# EAGLE design POVDisplayBase (EAGLE 7.4.0)
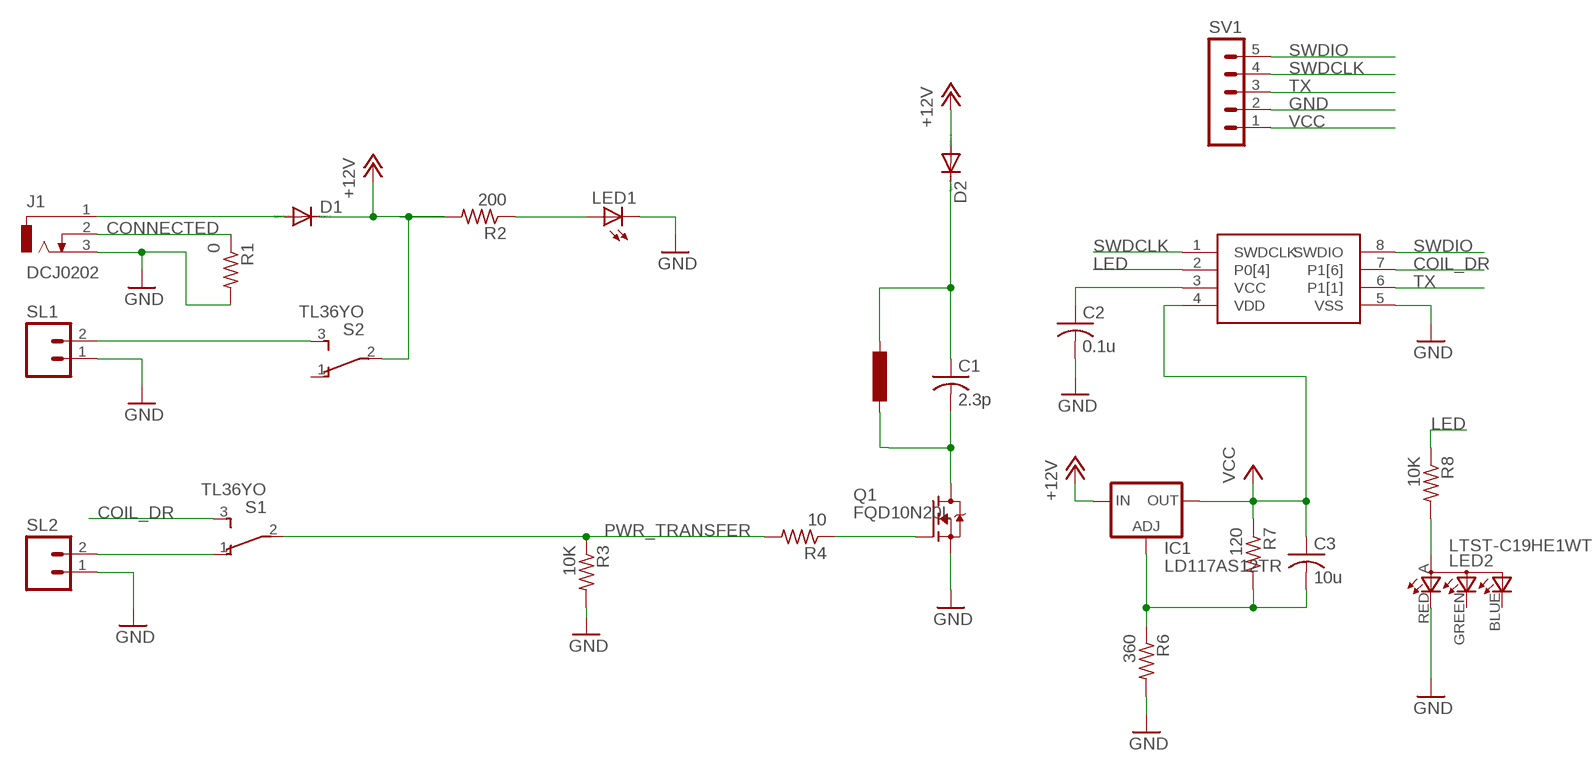
[diagram p0: schematic, sheet 1]
L1 (L): INDUCTANCE: 36.2uH

## Parts
C1  2.3p  C-USC1210  [C1210]
C2  0.1u  C-USC0603  [C0603]
C3  10u  C-USC0603  [C0603]
D1  DIODE-DO-214AC  [DO-214AC]
D2  DIODE-SMC  [SMC]
IC1  LD117AS12TR  [SOT223]
J1  DCJ0202  [DCJ0202]
LED1  LEDCHIPLED_1206  [CHIPLED_1206]
LED2  LTST-C19HE1WT  [LTST-C19HE1WT]
Q1  FQD10N20L  [TO252]
R1  0  R-US_R0603  [R0603]
R2  200  R-US_R0603  [R0603]
R3  10K  R-US_R0603  [R0603]
R4  10  R-US_R0603  [R0603]
R6  360  R-US_R0603  [R0603]
R7  120  R-US_R0603  [R0603]
R8  10K  R-US_R0603  [R0603]
S1  TL36YO  [TL3XYO]
S2  TL36YO  [TL3XYO]
SL1  M02  [02P]
SL2  M02  [02P]
SV1  MA05-1  [MA05-1]
U1  CY8C4013SXI-400  [SOIC08]

## Nets
+12V: D1.C D2.A IC1.3(IN) R2.2 S2.2(P)
COIL_DR: S1.3(S) U1.7(P1[6])
CONNECTED: J1.2 R1.1
GND: C2.2 J1.3 LED1.C LED2.RED(CRED) Q1.2(S) R1.2 R3.2 R6.2 SL1.1 SL2.1 SV1.2 U1.5(VSS)
LED: R8.1 U1.2(P0[4])
N$1: Q1.1(G) R4.1
N$2: LED1.A R2.1
N$3: S2.3(S) SL1.2
N$4: D1.A J1.1
N$5: C3.2 IC1.1(ADJ) R6.1 R7.2
N$6: LED2.A R8.2
N$7: C2.1 U1.3(VCC)
N$13: S1.1(O) SL2.2
NEG_COIL: C1.2 Q1.3(D)
POS_COIL: C1.1 D2.C
PWR_TRANSFER: R3.1 R4.2 S1.2(P)
SWDCLK: SV1.4 U1.1(SWDCLK)
SWDIO: SV1.5 U1.8(SWDIO)
TX: SV1.3 U1.6(P1[1])
VCC: C3.1 IC1.4(OUT) R7.1 SV1.1 U1.4(VDD)
Unconnected: LED2.BLUE(CBLUE) LED2.GREEN(CGREEN) S2.1(O)

## Library data of the parts
C1-C3 = resistor:C-US: CAPACITOR, American symbol
D1 = diode:DIODE-: DIODE; DIGIKEY: 641-1707-1-ND
D2 = diode:DIODE-: DIODE; DIGIKEY: S5KC-FDICT-ND
IC1 = v-reg:LD117A?*: Low drop fixed and adjustable positive voltage regulators 1 A Source: http://www.st.com/stonline/products/literature/ds/7194/ld1117axx.pdf
J1 = con-jack:DCJ0202: DC POWER JACK Source: DCJ0202.pdf; DIGIKEY: CP-002B-ND; MATING_CONN: CP3-1001-ND; OC_FARNELL: unknown; OC_NEWARK: unknown
LED1 = led:LED: LED OSRAM: - CHIPLED LG R971, LG N971, LY N971, LG Q971, LY Q971, LO R971, LY R971 LH N974, LH R974 LS Q976, LO Q976, LY Q976 LO Q996 - Hyper CHIPLED LW Q18S LB Q993, LB Q99A, LB R99A - SideLED LS A670, LO A670, LY A670, LG A670, LP A670 LB A673, LV A673, LT A673, LW A673 LH A674 LY A675 LS A676, LA A676, LO A676, LY A676, LW A676 LS A679, LY A679, LG A679 - Hyper Micro SIDELED® LS Y876, LA Y876, LO Y876, LY Y876 LT Y87S - SmartLED LW L88C, LW L88S LB L89C, LB L89S, LG L890 LS L89K, LO L89K, LY L89K LS L896, LA L896, LO L896, LY L896 - TOPLED LS T670, LO T670, LY T670, LG T670, LP T670 LSG T670, LSP T670, LSY T670, LOP T670, LYG T670 LG T671, LOG T671, LSG T671 LB T673, LV T673, LT T673, LW T673 LH T674 LS T676, LA T676, LO T676, LY T676, LB T676, LH T676, LSB T676, LW T676 LB T67C, LV T67C, LT T67C, LS T67K, LO T67K, LY T67K, LW E67C LS E67B, LA E67B, LO E67B, LY E67B, LB E67C, LV E67C, LT E67C LW T67C LS T679, LY T679, LG T679 LS T770, LO T770, LY T770, LG T770, LP T770 LB T773, LV T773, LT T773, LW T773 LH T774 LS E675, LA E675, LY E675, LS T675 LS T776, LA T776, LO T776, LY T776, LB T776 LHGB T686 LT T68C, LB T68C - Hyper Mini TOPLED® LB M676 - Mini TOPLED Santana® LG M470 LS M47K, LO M47K, LY M47K Source: http://www.osram.convergy.de LUXEON: - LUMILED® LXK2-PW12-R00, LXK2-PW12-S00, LXK2-PW14-U00, LXK2-PW14-V00 LXK2-PM12-R00, LXK2-PM12-S00, LXK2-PM14-U00 LXK2-PE12-Q00, LXK2-PE12-R00, LXK2-PE12-S00, LXK2-PE14-T00, LXK2-PE14-U00 LXK2-PB12-K00, LXK2-PB12-L00, LXK2-PB12-M00, LXK2-PB14-N00, LXK2-PB14-P00, LXK2-PB14-Q00 LXK2-PR12-L00, LXK2-PR12-M00, LXK2-PR14-Q00, LXK2-PR14-R00 LXK2-PD12-Q00, LXK2-PD12-R00, LXK2-PD12-S00 LXK2-PH12-R00, LXK2-PH12-S00 LXK2-PL12-P00, LXK2-PL12-Q00, LXK2-PL12-R00 Source: www.luxeon.com KINGBRIGHT: KA-3528ASYC Source: www.kingbright.com; DIGIKEY: 1080-1346-1-ND
LED2 = NicksParts:LTST-C19HE1WT
Q1 = NicksParts:FQD10N20L; DIGIKEY: FQD10N20LTMCT-ND
R1-R4 R6-R8 = resistor:R-US_: RESISTOR, American symbol; DIGIKEY: P180GCT-ND
S1 S2 = switch:TL36YO: TINY SWITCH ON - ON Source: http://www2.produktinfo.conrad.com/datenblaetter/700000-724999/705152-da-01-de-Subminiaturschalter_TL_36YO.pdf; DIGIKEY: 450-1603-ND
SL1 SL2 = con-amp-quick:M02: AMP QUICK CONNECTOR; OC_FARNELL: unknown; OC_NEWARK: unknown
SV1 = con-lstb:MA05-1: PIN HEADER; OC_FARNELL: unknown; OC_NEWARK: unknown
U1 = NicksParts:CY8C4013SXI-400

## Board
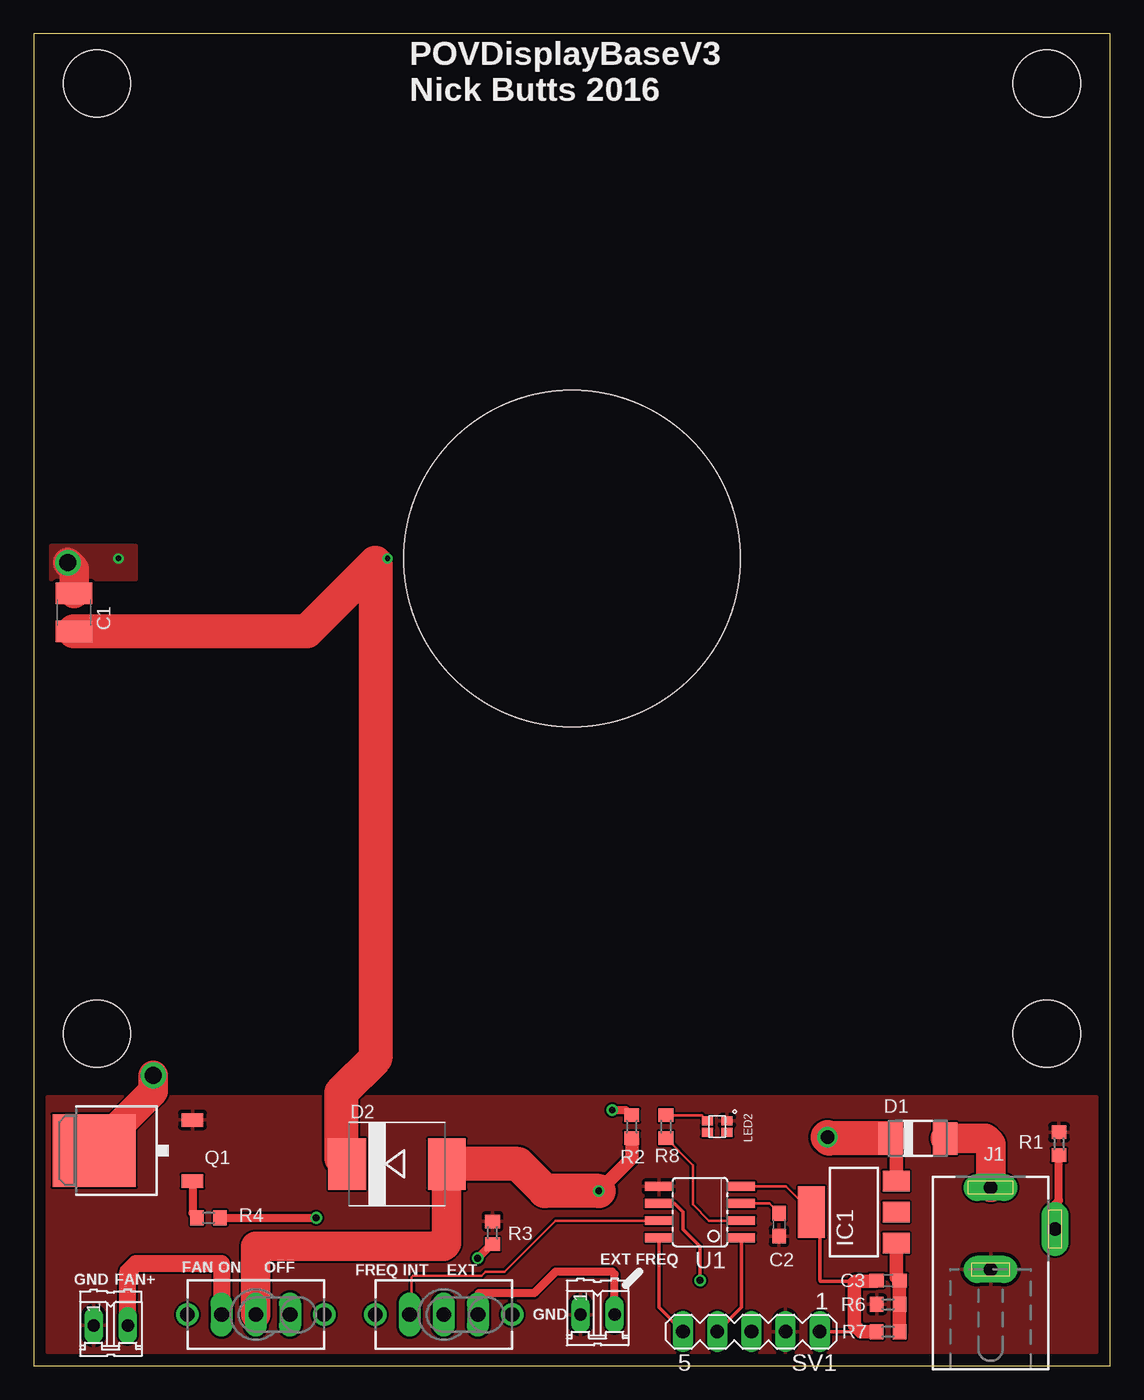
[diagram p1: board, top side]
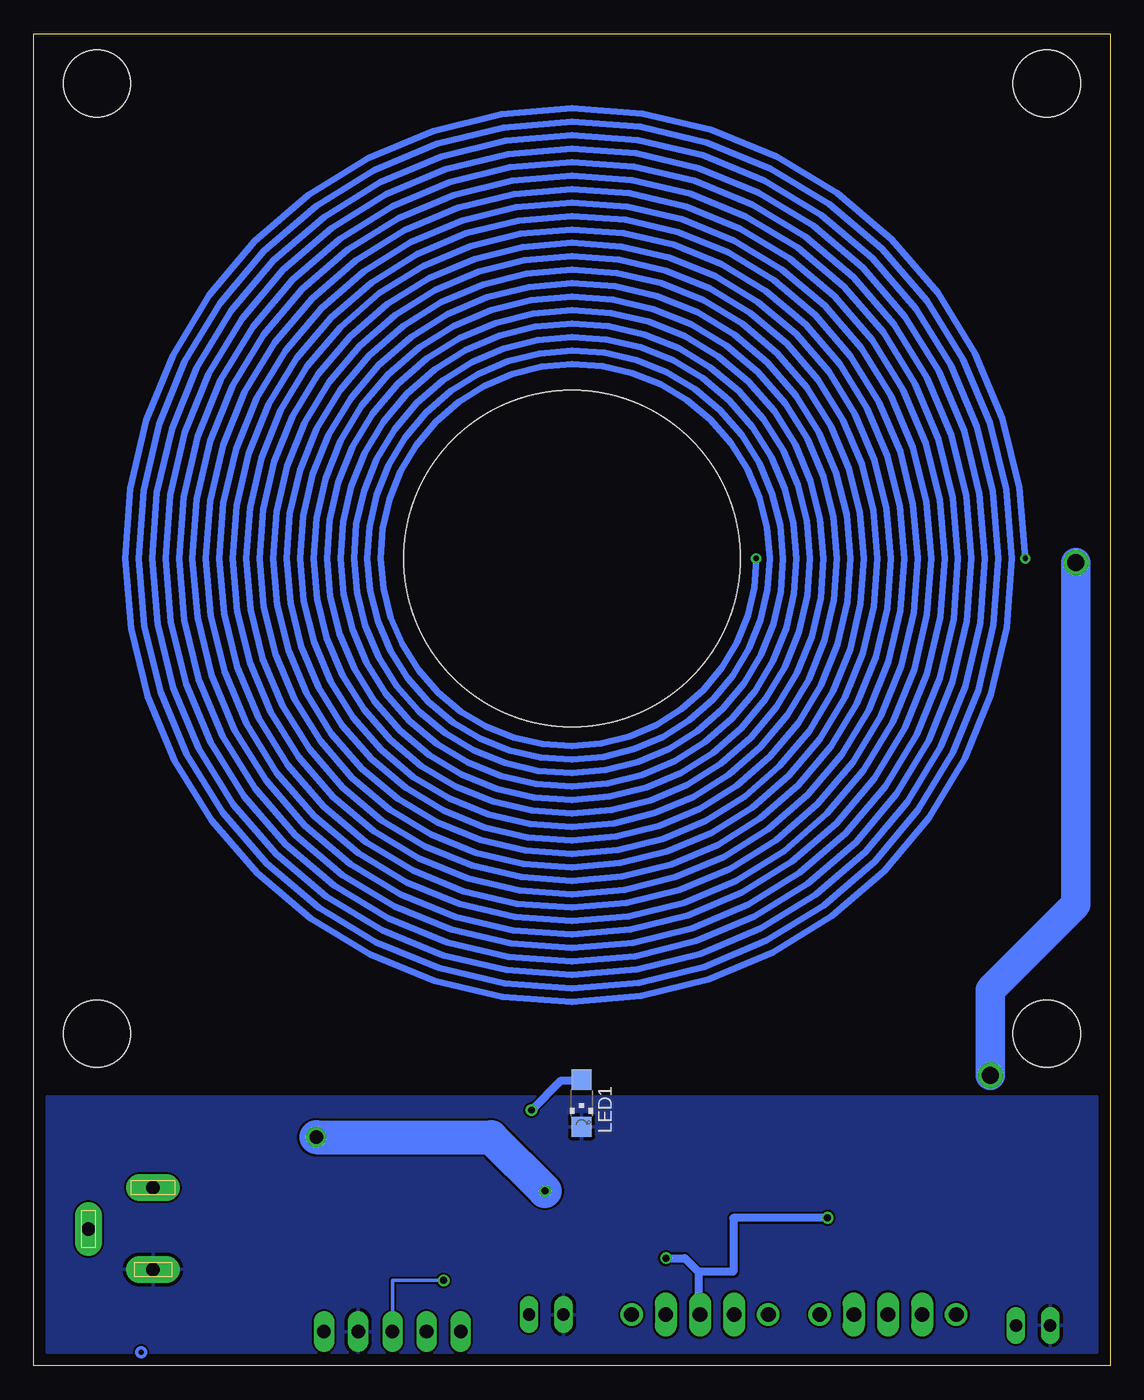
[diagram p2: board, bottom side, seen from below]

Size 80 x 99 mm. Coordinates in mm from the lower left corner, seen from the top.
Outline: 0,0 80,0 80,99 0,99 0,0
Copper layers (1*16): Top 0.0356mm / dielectric 1.5011mm / Bottom 0.0356mm
Design rules "oshpark-2layer": minimum track width 6mil, minimum drill 13mil, track to track 6mil, track to pad 6mil, pad to pad 6mil, via to via 6mil, smd to smd 6mil, copper to edge 15mil, drill to drill 6mil, minimum pad ring 7mil, minimum via ring 7mil, stop-mask expansion 4mil, vias tented up to drill 0mil, thermal gap 10mil
Holes 25 mm at 40,60
Holes 5 mm at 4.7,95.3 75.3,95.3 4.7,24.7 75.3,24.7

### Footprints (pad centres in the part's own frame; a part is rotated, then mirrored left to right if it is on the bottom)
C1210 = smd 1.6 x 2.7: 1 -1.4,0; 2 1.4,0
C0603 = smd 1.1 x 1: 1 -0.85,0; 2 0.85,0
DO-214AC = smd 1.8 x 2.4: A 2.025,0; C -2.025,0
SMC = smd 2.8 x 3.8: A 3.7,0; C -3.7,0
SOT223 = smd 1.5 x 2: 1 -2.3,-3.15; 2 0,-3.15; 3 2.3,-3.15 | smd 3.8 x 2: 4 0,3.15
DCJ0202 = drill 1 pad 2 long: 1 0,3.1; 2 4.8,0; 3 0,-3
CHIPLED_1206 = smd 1.5 x 1.5: A 0,-1.75; C 0,1.75
LTST-C19HE1WT = smd 0.65 x 0.85: A -0.425,-0.725; BLUE 0.425,-0.725; GREEN 0.425,0.725; RED -0.425,0.725
TO252 = smd 1 x 1.6: 1 -2.28,-4.8; 2 2.28,-4.8 | smd 5.4 x 6.2: 3 0,2.5
R0603 = smd 1 x 1.1: 1 -0.85,0; 2 0.85,0
TL3XYO = drill 1.1 pad 1.422 long: 1 -2.54,0; 2 0,0; 3 2.54,0 | drill 1.1 pad 1.676: M1 -5.08,0; M2 5.08,0
02P = drill 0.914 long: 1 -1.27,0; 2 1.27,0
MA05-1 = drill 1.016 long: 1 -5.08,0; 2 -2.54,0; 3 0,0; 4 2.54,0; 5 5.08,0
SOIC08 = smd 0.66 x 2.032: 1 -1.905,-3.073; 2 -0.635,-3.073; 3 0.635,-3.073; 4 1.905,-3.073; 5 1.905,3.073; 6 0.635,3.073; 7 -0.635,3.073; 8 -1.905,3.073

### Placement (x,y rotation side)
C1  3,56 90 top
C2  55.39,10.49 270 top
C3  63.5,6.35 0 top
D1  65.72,16.89 0 top
D2  27,15 0 top
IC1  60.96,11.43 90 top
J1  71.12,10.16 0 top
LED1  39.28,19.52 180 bottom
LED2  50.8,17.78 270 top
Q1  7,16 90 top
R1  76.2,16.51 90 top
R2  44.45,17.78 270 top
R3  34.1,9.89 90 top
R4  13,11 0 top
R6  63.5,4.57 180 top
R7  63.5,2.54 0 top
R8  46.99,17.78 90 top
S1  30.48,3.81 180 top
S2  16.51,3.81 180 top
SL1  5.73,3 0 top
SL2  41.91,3.81 0 top
SV1  53.34,2.54 180 top
U1  49.53,11.43 90 top

### Tracks (layer width: path | path; a pad name or v marks a point on that pad's centre or on a via)
+12V  (via drill 0.51, 1)
  Top 0.2: 31,15 D2.A
  Top 1.016: IC1.3 64.11,16.48 D1.C | R2.2 44.45,15.45 v42,13
  Top 2.184: D2.A 30.7,9.11 30.48,8.89 16.51,8.89 S2.2
  Top 2.54: D1.C 59.11,16.89 v59,17 | v42,13 38,13 36,15 31,15
  Bottom 2.54: v59,17 46,17 v42,13
COIL_DR
  Top 0.2: U1.7 38.8,10.79 35,7 33.6,7 33.3,6.7 28.2,6.7 28.1,6.6 28.1,3.97 S1.3
CONNECTED
  Top 0.61: J1.2 75.92,12.02 76.2,12.3 R1.1
GND
  pour Top: 1,20 79,20 79,1 1,1
  pour Bottom: 79,20 1,20 1,1 79,1
LED
  Top 0.2: U1.2 50.2,10.79 49,12 49,14.92 R8.1
N$1
  Top 0.61: Q1.1 11.8,11.35 R4.1
N$2  (via drill 0.51)
  Top 0.61: R2.1 44.37,18.63 44,19 v43,19
  Bottom 0.61: v43,19 40.8,21.2 39.35,21.2 LED1.A
N$3
  Top 1.27: SL1.2 7,7 7.62,7.62 13.97,7.62 S2.3
N$4
  Top 2.184: D1.A 70.74,16.89 71.12,16.51 J1.1
N$5
  Top 1.016: IC1.1 64.11,6.59 C3.2 R6.1 R7.2
N$6
  Top 0.2: R8.2 49.65,18.63 LED2.A
N$7
  Top 0.2: U1.3 54.66,12.06 C2.1
N$13
  Top 0.61: SL2.2 43.18,6.82 43,7 38.8,7 37.2,5.4 33.1,5.4 33.1,3.89 S1.1
NEG_COIL  (via drill 0.4 pad 0.5, 1.27)
  Top 2.184: C1.2 3,59.23 v2.54,59.69 | v8.89,21.59 8.89,20.39 Q1.3
  Bottom 0.5: v26.3,60 26.44,57.85 26.92,55.75 27.73,53.75 28.84,51.89 30.22,50.22 31.86,48.8 33.7,47.64 35.7,46.78 37.82,46.25 40,46.05 42.19,46.2 44.33,46.69 46.37,47.5 48.26,48.63 49.95,50.05 51.41,51.71 52.59,53.59 53.46,55.63 54,57.78 54.2,60 54.05,62.23 53.55,64.4 52.72,66.48 51.57,68.41 50.13,70.13 48.44,71.61 46.53,72.81 44.45,73.69 42.26,74.25 40,74.45 37.74,74.3 35.52,73.79 33.41,72.94 31.45,71.77 29.69,70.31 28.19,68.58 26.97,66.64 26.07,64.53 25.51,62.3 25.3,60 25.46,57.7 25.97,55.44 26.84,53.29 28.03,51.3 29.52,49.52 31.27,47.99 33.25,46.75 35.4,45.83 37.66,45.26 40,45.05 42.34,45.21 44.63,45.73 46.82,46.61 48.85,47.82 50.66,49.34 52.22,51.12 53.48,53.13 54.41,55.32 54.99,57.63 55.2,60 55.04,62.38 54.5,64.71 53.61,66.94 52.38,68.99 50.84,70.84 49.02,72.42 46.98,73.7 44.76,74.65 42.41,75.23 40,75.45 37.58,75.28 35.21,74.74 32.95,73.83 30.86,72.58 28.99,71.01 27.38,69.17 26.08,67.09 25.12,64.84 24.52,62.45 24.3,60 24.47,57.54 25.02,55.13 25.94,52.84 27.22,50.71 28.81,48.81 30.68,47.18 32.79,45.85 35.09,44.88 37.51,44.27 40,44.05 42.5,44.22 44.94,44.78 47.27,45.72 49.43,47.02 51.37,48.63 53.02,50.54 54.37,52.68 55.36,55.01 55.98,57.47 56.2,60 56.02,62.54 55.45,65.02 54.5,67.39 53.19,69.58 51.54,71.54 49.61,73.23 47.43,74.59 45.07,75.6 42.57,76.22 40,76.45 37.42,76.27 34.9,75.69 32.5,74.72 30.27,73.39 28.28,71.72 26.57,69.76 25.19,67.55 24.16,65.14 23.53,62.61 23.3,60 23.48,57.38 24.07,54.82 25.05,52.38 26.41,50.12 28.1,48.1 30.1,46.37 32.34,44.96 34.78,43.93 37.35,43.28 40,43.05 42.66,43.23 45.25,43.83 47.73,44.83 50.02,46.21 52.07,47.93 53.83,49.95 55.26,52.23 56.31,54.7 56.96,57.31 57.2,60 57.01,62.7 56.41,65.33 55.39,67.84 54,70.17 52.25,72.25 50.2,74.04 47.89,75.48 45.38,76.55 42.73,77.21 40,77.45 37.27,77.26 34.59,76.64 32.04,75.61 29.68,74.2 27.57,72.43 25.76,70.34 24.3,68 23.21,65.45 22.54,62.77 22.3,60 22.49,57.23 23.12,54.52 24.16,51.93 25.6,49.54 27.4,47.4 29.51,45.56 31.89,44.07 34.47,42.98 37.2,42.3 40,42.05 42.81,42.25 45.56,42.88 48.18,43.94 50.61,45.4 52.78,47.22 54.64,49.36 56.15,51.77 57.26,54.39 57.95,57.16 58.2,60 58,62.85 57.36,65.64 56.28,68.3 54.8,70.76 52.96,72.96 50.79,74.85 48.34,76.37 45.69,77.5 42.88,78.2 40,78.45 37.11,78.25 34.28,77.59 31.59,76.51 29.1,75.01 26.87,73.14 24.95,70.93 23.41,68.46 22.26,65.76 21.55,62.92 21.3,60 21.51,57.07 22.17,54.21 23.27,51.48 24.79,48.95 26.69,46.69 28.92,44.75 31.43,43.18 34.16,42.02 37.04,41.31 40,41.05 42.97,41.26 45.87,41.93 48.64,43.05 51.2,44.59 53.49,46.51 55.45,48.77 57.04,51.32 58.21,54.08 58.94,57 59.2,60 58.99,63.01 58.31,65.95 57.17,68.75 55.61,71.34 53.66,73.67 51.37,75.65 48.8,77.26 45.99,78.45 43.04,79.19 40,79.45 36.95,79.23 33.97,78.55 31.14,77.4 28.51,75.82 26.16,73.84 24.14,71.52 22.51,68.91 21.31,66.07 20.57,63.08 20.3,60 20.52,56.91 21.22,53.9 22.38,51.02 23.98,48.36 25.98,45.98 28.33,43.94 30.98,42.29 33.85,41.07 36.88,40.32 40,40.05 43.12,40.27 46.18,40.98 49.09,42.16 51.78,43.78 54.2,45.8 56.26,48.19 57.93,50.86 59.16,53.77 59.93,56.84 60.2,60 59.98,63.16 59.26,66.26 58.06,69.2 56.42,71.93 54.37,74.37 51.96,76.46 49.25,78.15 46.3,79.4 43.2,80.17 40,80.45 36.8,80.22 33.66,79.5 30.68,78.29 27.92,76.62 25.45,74.55 23.33,72.11 21.62,69.36 20.36,66.38 19.58,63.23 19.3,60 19.53,56.76 20.27,53.59 21.49,50.57 23.17,47.77 25.27,45.27 27.75,43.13 30.52,41.4 33.54,40.12 36.73,39.33 40,39.05 43.28,39.28 46.49,40.03 49.55,41.27 52.37,42.97 54.9,45.1 57.07,47.6 58.82,50.41 60.12,53.46 60.91,56.69 61.2,60 60.96,63.32 60.21,66.57 58.96,69.66 57.23,72.52 55.08,75.08 52.55,77.27 49.7,79.05 46.61,80.35 43.35,81.16 40,81.45 36.64,81.21 33.36,80.45 30.23,79.18 27.33,77.43 24.74,75.26 22.52,72.7 20.73,69.82 19.41,66.69 18.59,63.39 18.3,60 18.54,56.6 19.31,53.28 20.6,50.11 22.36,47.19 24.57,44.57 27.16,42.32 30.07,40.51 33.23,39.17 36.57,38.34 40,38.05 43.44,38.3 46.8,39.08 50,40.38 52.96,42.16 55.61,44.39 57.88,47.01 59.71,49.96 61.07,53.16 61.9,56.53 62.2,60 61.95,63.48 61.16,66.88 59.85,70.11 58.04,73.11 55.79,75.79 53.14,78.08 50.16,79.94 46.92,81.3 43.51,82.15 40,82.45 36.48,82.2 33.05,81.4 29.77,80.07 26.75,78.24 24.04,75.96 21.72,73.28 19.84,70.27 18.46,67 17.6,63.55 17.3,60 17.55,56.45 18.36,52.97 19.71,49.66 21.55,46.6 23.86,43.86 26.57,41.51 29.61,39.62 32.92,38.22 36.41,37.36 40,37.05 43.59,37.31 47.11,38.13 50.45,39.48 53.55,41.35 56.32,43.68 58.69,46.42 60.6,49.5 62.02,52.85 62.89,56.38 63.2,60 62.94,63.63 62.11,67.19 60.74,70.57 58.85,73.69 56.49,76.49 53.73,78.89 50.61,80.83 47.23,82.25 43.66,83.14 40,83.45 36.33,83.19 32.74,82.35 29.32,80.96 26.16,79.05 23.33,76.67 20.91,73.87 18.95,70.72 17.51,67.31 16.62,63.7 16.3,60 16.57,56.29 17.41,52.66 18.82,49.21 20.75,46.01 23.15,43.15 25.98,40.7 29.16,38.73 32.61,37.27 36.26,36.37 40,36.05 43.75,36.32 47.42,37.17 50.91,38.59 54.14,40.54 57.02,42.98 59.5,45.83 61.49,49.05 62.97,52.54 63.88,56.22 64.2,60 63.93,63.79 63.06,67.49 61.63,71.02 59.66,74.28 57.2,77.2 54.31,79.7 51.07,81.72 47.54,83.21 43.82,84.12 40,84.45 36.17,84.17 32.43,83.3 28.87,81.85 25.57,79.86 22.62,77.38 20.1,74.46 18.06,71.18 16.56,67.62 15.63,63.86 15.3,60 15.58,56.13 16.46,52.35 17.93,48.75 19.94,45.42 22.45,42.45 25.39,39.9 28.71,37.84 32.31,36.32 36.1,35.38 40,35.05 43.91,35.33 47.73,36.22 51.36,37.7 54.72,39.73 57.73,42.27 60.31,45.25 62.39,48.59 63.92,52.23 64.86,56.06 65.2,60 64.91,63.95 64.01,67.8 62.52,71.47 60.47,74.87 57.91,77.91 54.9,80.51 51.52,82.61 47.85,84.16 43.98,85.11 40,85.45 36.02,85.16 32.12,84.25 28.41,82.74 24.98,80.67 21.92,78.08 19.29,75.05 17.17,71.63 15.61,67.93 14.64,64.02 14.3,60 14.59,55.98 15.51,52.04 17.03,48.3 19.13,44.84 21.74,41.74 24.81,39.09 28.25,36.95 32,35.37 35.94,34.39 40,34.05 44.06,34.34 48.03,35.27 51.81,36.81 55.31,38.92 58.44,41.56 61.12,44.66 63.28,48.14 64.87,51.92 65.85,55.91 66.2,60 65.9,64.1 64.97,68.11 63.41,71.93 61.28,75.46 58.62,78.61 55.49,81.32 51.97,83.5 48.16,85.11 44.13,86.1 40,86.45 35.86,86.15 31.81,85.2 27.96,83.63 24.39,81.48 21.21,78.79 18.48,75.64 16.28,72.09 14.65,68.23 13.65,64.17 13.3,60 13.6,55.82 14.56,51.73 16.14,47.84 18.32,44.25 21.03,41.03 24.22,38.28 27.8,36.05 31.69,34.42 35.79,33.41 40,33.05 44.22,33.36 48.34,34.32 52.27,35.92 55.9,38.12 59.15,40.85 61.92,44.07 64.17,47.69 65.82,51.61 66.84,55.75 67.2,60 66.89,64.26 65.92,68.42 64.3,72.38 62.09,76.05 59.32,79.32 56.08,82.13 52.43,84.39 48.47,86.06 44.29,87.09 40,87.45 35.7,87.14 31.5,86.15 27.5,84.53 23.81,82.29 20.5,79.5 17.67,76.22 15.39,72.54 13.7,68.54 12.67,64.33 12.3,60 12.62,55.66 13.61,51.42 15.25,47.39 17.51,43.66 20.32,40.33 23.63,37.47 27.34,35.16 31.38,33.47 35.63,32.42 40,32.05 44.38,32.37 48.65,33.37 52.72,35.03 56.49,37.31 59.85,40.15 62.73,43.48 65.06,47.23 66.77,51.3 67.83,55.59 68.2,60 67.88,64.42 66.87,68.73 65.19,72.84 62.9,76.63 60.03,80.03 56.66,82.94 52.88,85.28 48.78,87.01 44.45,88.08 40,88.45 35.55,88.12 31.19,87.11 27.05,85.42 23.22,83.1 19.79,80.21 16.86,76.81 14.49,73 12.75,68.85 11.68,64.49 11.3,60 11.63,55.51 12.66,51.12 14.36,46.94 16.7,43.07 19.62,39.62 23.04,36.66 26.89,34.27 31.07,32.51 35.48,31.43 40,31.05 44.53,31.38 48.96,32.42 53.18,34.14 57.08,36.5 60.56,39.44 63.54,42.9 65.95,46.78 67.72,50.99 68.82,55.44 69.2,60 68.86,64.57 67.82,69.04 66.08,73.29 63.7,77.22 60.74,80.74 57.25,83.75 53.34,86.17 49.09,87.96 44.6,89.06 40,89.45 35.39,89.11 30.88,88.06 26.6,86.31 22.63,83.91 19.09,80.91 16.05,77.4 13.6,73.45 11.8,69.16 10.69,64.64 10.3,60 10.64,55.35 11.71,50.81 13.47,46.48 15.89,42.48 18.91,38.91 22.45,35.85 26.44,33.38 30.76,31.56 35.32,30.44 40,30.05 44.69,30.39 49.27,31.47 53.63,33.25 57.66,35.69 61.27,38.73 64.35,42.31 66.84,46.32 68.67,50.68 69.8,55.28 70.2,60 69.85,64.73 68.77,69.35 66.97,73.75 64.51,77.81 61.44,81.44 57.84,84.55 53.79,87.06 49.39,88.91 44.76,90.05 40,90.45 35.23,90.1 30.57,89.01 26.14,87.2 22.04,84.72 18.38,81.62 15.24,77.99 12.71,73.9 10.85,69.47 9.7,64.8 9.3,60 9.65,55.19 10.76,50.5 12.58,46.03 15.08,41.9 18.2,38.2 21.87,35.04 25.98,32.49 30.45,30.61 35.16,29.46 40,29.05 44.85,29.41 49.58,30.52 54.09,32.36 58.25,34.88 61.97,38.03 65.16,41.72 67.73,45.87 69.62,50.37 70.79,55.12 71.2,60 70.84,64.89 69.72,69.66 67.87,74.2 65.32,78.4 62.15,82.15 58.43,85.36 54.24,87.95 49.7,89.86 44.92,91.04 40,91.45 35.08,91.09 30.27,89.96 25.69,88.09 21.45,85.53 17.67,82.33 14.44,78.57 11.82,74.36 9.9,69.78 8.71,64.95 8.3,60 8.67,55.04 9.8,50.19 11.69,45.58 14.27,41.31 17.5,37.5 21.28,34.23 25.53,31.6 30.14,29.66 35.01,28.47 40,28.05 45,28.42 49.89,29.57 54.54,31.46 58.84,34.07 62.68,37.32 65.97,41.13 68.62,45.42 70.58,50.06 71.78,54.97 72.2,60 71.83,65.04 70.67,69.97 68.76,74.65 66.13,78.99 62.86,82.86 59.02,86.17 54.7,88.85 50.01,90.81 45.07,92.03 40,92.45 34.92,92.08 29.96,90.91 25.23,88.98 20.87,86.33 16.97,83.03 13.63,79.16 10.93,74.81 8.95,70.09 7.73,65.11 7.3,60 7.68,54.88 8.85,49.88 10.8,45.12 13.46,40.72 16.79,36.79 20.69,33.42 25.07,30.71 29.83,28.71 34.85,27.48 40,27.05 45.16,27.43 50.2,28.61 54.99,30.57 59.43,33.26 63.39,36.61 66.78,40.54 69.52,44.96 71.53,49.76 72.77,54.81 73.2,60 72.82,65.2 71.62,70.28 69.65,75.11 66.94,79.57 63.56,83.56 59.6,86.98 55.15,89.74 50.32,91.77 45.23,93.01 40,93.45 34.76,93.06 29.65,91.86 24.78,89.87 20.28,87.14 16.26,83.74 12.82,79.75 10.04,75.27 8,70.4 6.74,65.27 v6.3,60
  Bottom 2.184: v2.54,59.69 2.54,34.29 8.89,27.94 v8.89,21.59
  pour Top: 1.27,60.96 7.62,60.96 7.62,58.42 1.27,58.42
POS_COIL
  Top 2.54: C1.1 20.31,54.6 25.4,59.69 25.4,22.86 22.86,20.32 22.86,15.44 D2.C
PWR_TRANSFER  (via drill 0.51)
  Top 0.61: R4.2 v21,11 | R3.1 34.04,9.04 v33,8
  Bottom 0.61: v21,11 28,11 28,7 30.6,7 | 30.6,7 30.6,3.93 S1.2 | v33,8 31.6,8 30.6,7
SWDCLK
  Top 0.254: U1.1 52.6,4.34 SV1.4
SWDIO
  Top 0.254: U1.8 46.46,4.34 SV1.5
TX  (via drill 0.51)
  Top 0.254: U1.6 47.62,12.06 48.26,11.43 48.26,10.16 49.53,8.89 v49.53,6.35
  Bottom 0.254: v49.53,6.35 53.34,6.35 SV1.3
VCC
  Top 0.2: U1.4 55.91,13.34 IC1.4
  Top 0.254: SV1.1 60.96,2.54 61,2.58 61,3 | 61.1,6.3 58.47,6.3 58.42,6.35 58.42,10.82 IC1.4
  Top 1.016: R7.1 61.46,2.54 61,3 61,6.2 61.1,6.3 62.6,6.3 C3.1
(copper drawn outside any net)
  shapes: Bottom circle x1

### Text on the board
tNames: POVDisplayBaseV3 / Nick Butts 2016 | EXT FREQ | FAN ON OFF | FREQ INT EXT | GND | FAN+ | GND